# EAGLE design MoWeSta-Minimalist (EAGLE 9.6.2)
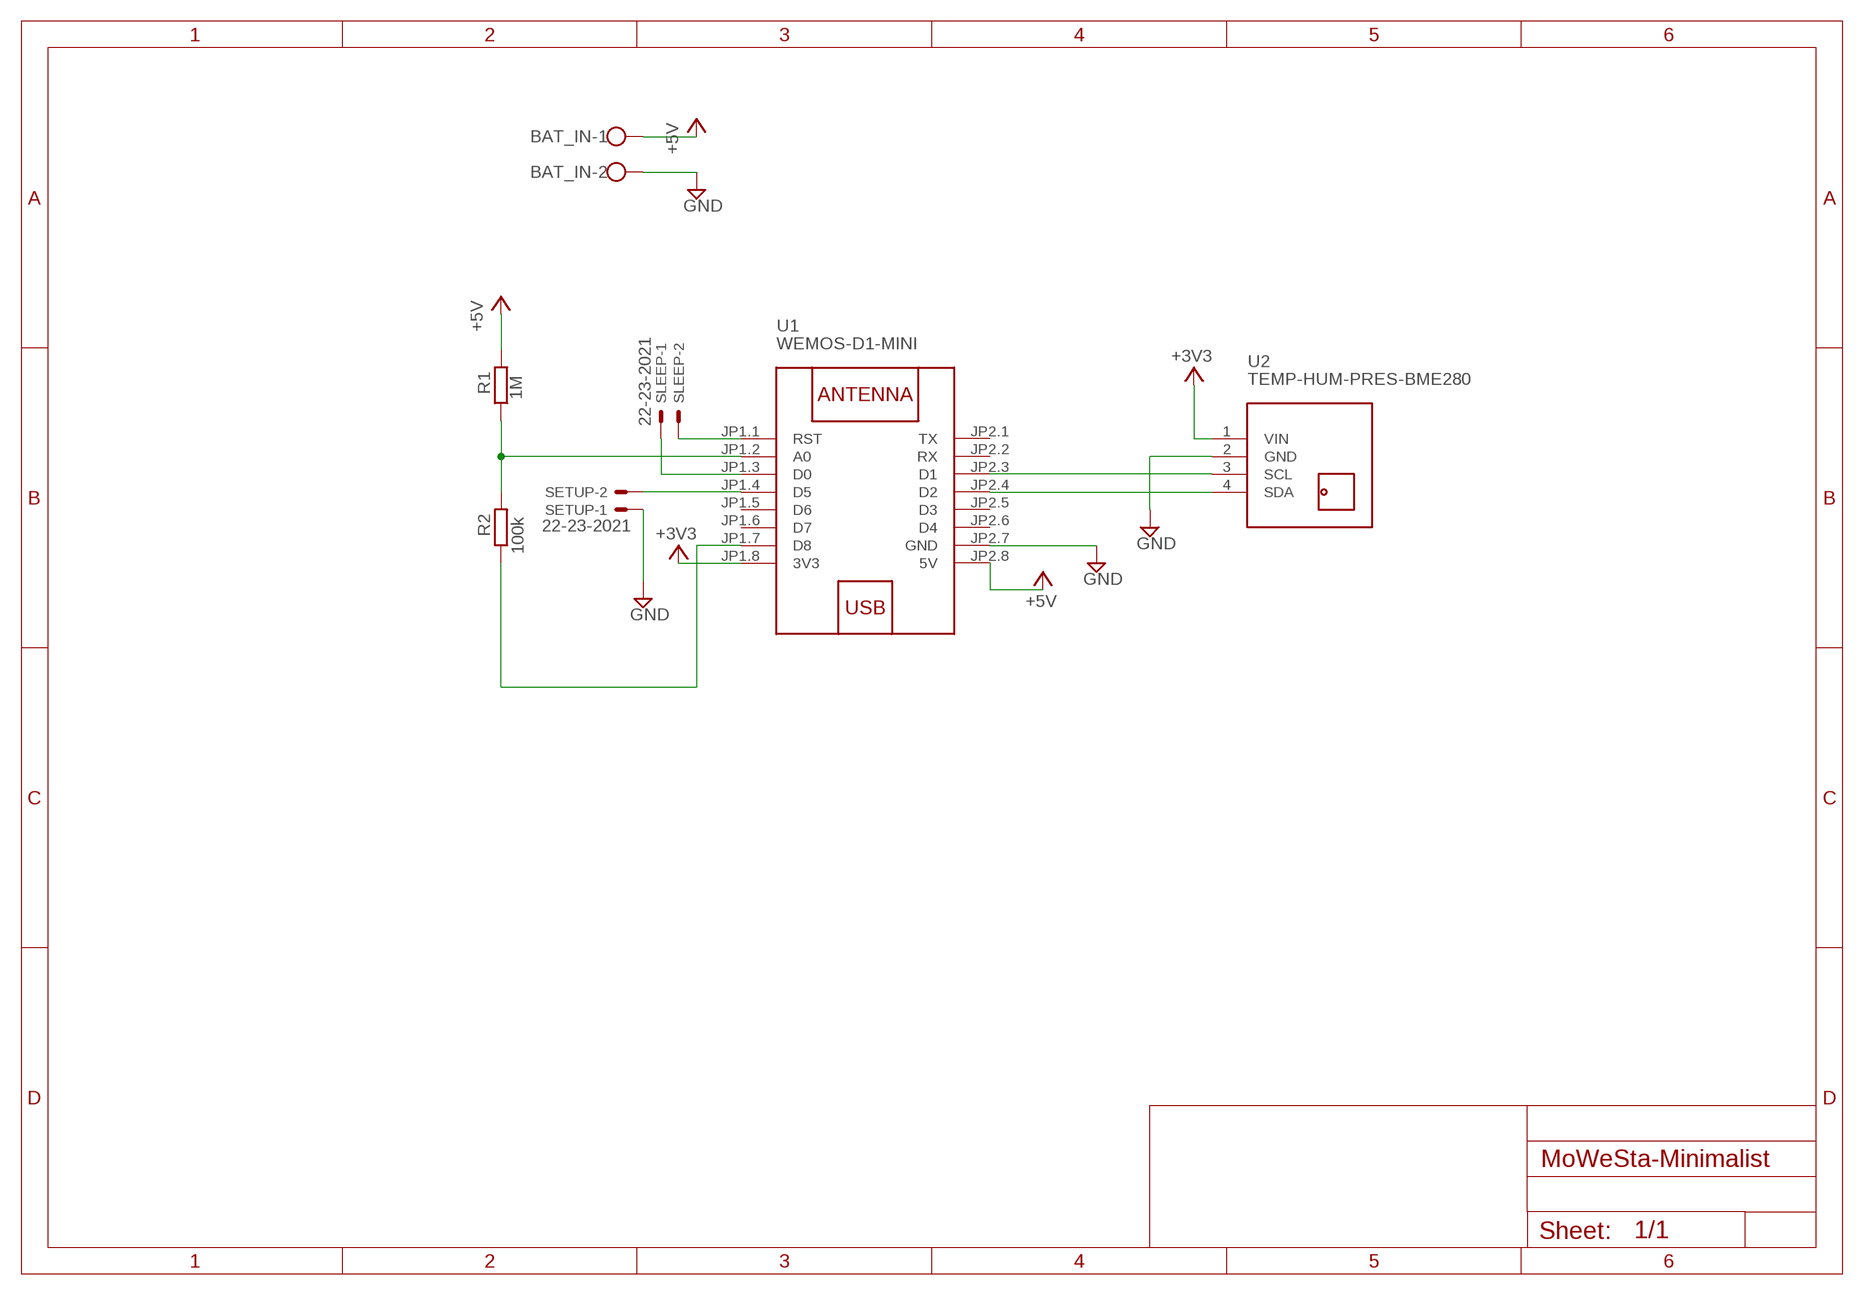
[diagram p0: schematic, sheet 1]

## Parts
BAT_IN  W237-102  [W237-102]
R1  1M  R-EU_0204/7  [0204/7]
R2  100k  R-EU_0204/7  [0204/7]
SETUP  22-23-2021  [22-23-2021]
SLEEP  22-23-2021  [22-23-2021]
U1  WEMOS-D1-MINI  [WEMOS-D1-MINI]
U2  TEMP-HUM-PRES-BME280  [TEMP-HUM-PRES-BME280]

## Nets
+3V3: U1.JP1.8(3V3) U2.1(VIN)
+5V: BAT_IN.1 R1.2 U1.JP2.8(5V)
GND: BAT_IN.2 SETUP.1 U1.JP2.7(GND) U2.2(GND)
N$1: R1.1 R2.2 U1.JP1.2(A0)
N$2: SLEEP.2 U1.JP1.1(RST)
N$3: SLEEP.1 U1.JP1.3(D0)
N$4: SETUP.2 U1.JP1.4(D5)
N$5: U1.JP2.3(D1) U2.3(SCL)
N$6: U1.JP2.4(D2) U2.4(SDA)
N$7: R2.1 U1.JP1.7(D8)
Unconnected: U1.JP1.5(D6) U1.JP1.6(D7) U1.JP2.1(TX) U1.JP2.2(RX) U1.JP2.5(D3) U1.JP2.6(D4)

## Library data of the parts
BAT_IN = con-wago-500:W237-102: WAGO SCREW CLAMP; MPN: 237-102; OC_FARNELL: unknown; OC_NEWARK: 70K9898
R1 R2 = rcl:R-EU_: RESISTOR, European symbol; SPICEPREFIX: R
SETUP SLEEP = con-molex:22-23-2021: .100" (2.54mm) Center Header - 2 Pin; MF: MOLEX; MPN: 22-23-2021; OC_FARNELL: 1462926; OC_NEWARK: 25C3832
U1 = diy-modules:WEMOS-D1-MINI: WEMOS D1 mini: Mini Wi-Fi Board based on ESP-8266 device More details can be found here: https://www.wemos.cc/product/d1-mini.html Click here to find device on ebay.com <http://www.ebay.com/sch/wemos+d1+mini+nodemcu>
U2 = diy-modules:TEMP-HUM-PRES-BME280: Digital Humidity-Temperature-Pressure Sensor based on BME280 device More information about BME280 device is available here: https://www.bosch-sensortec.com/bst/products/all_products/bme280 Click here to find device on ebay.com <http://www.ebay.com/sch/bme280+breakout>

## Board
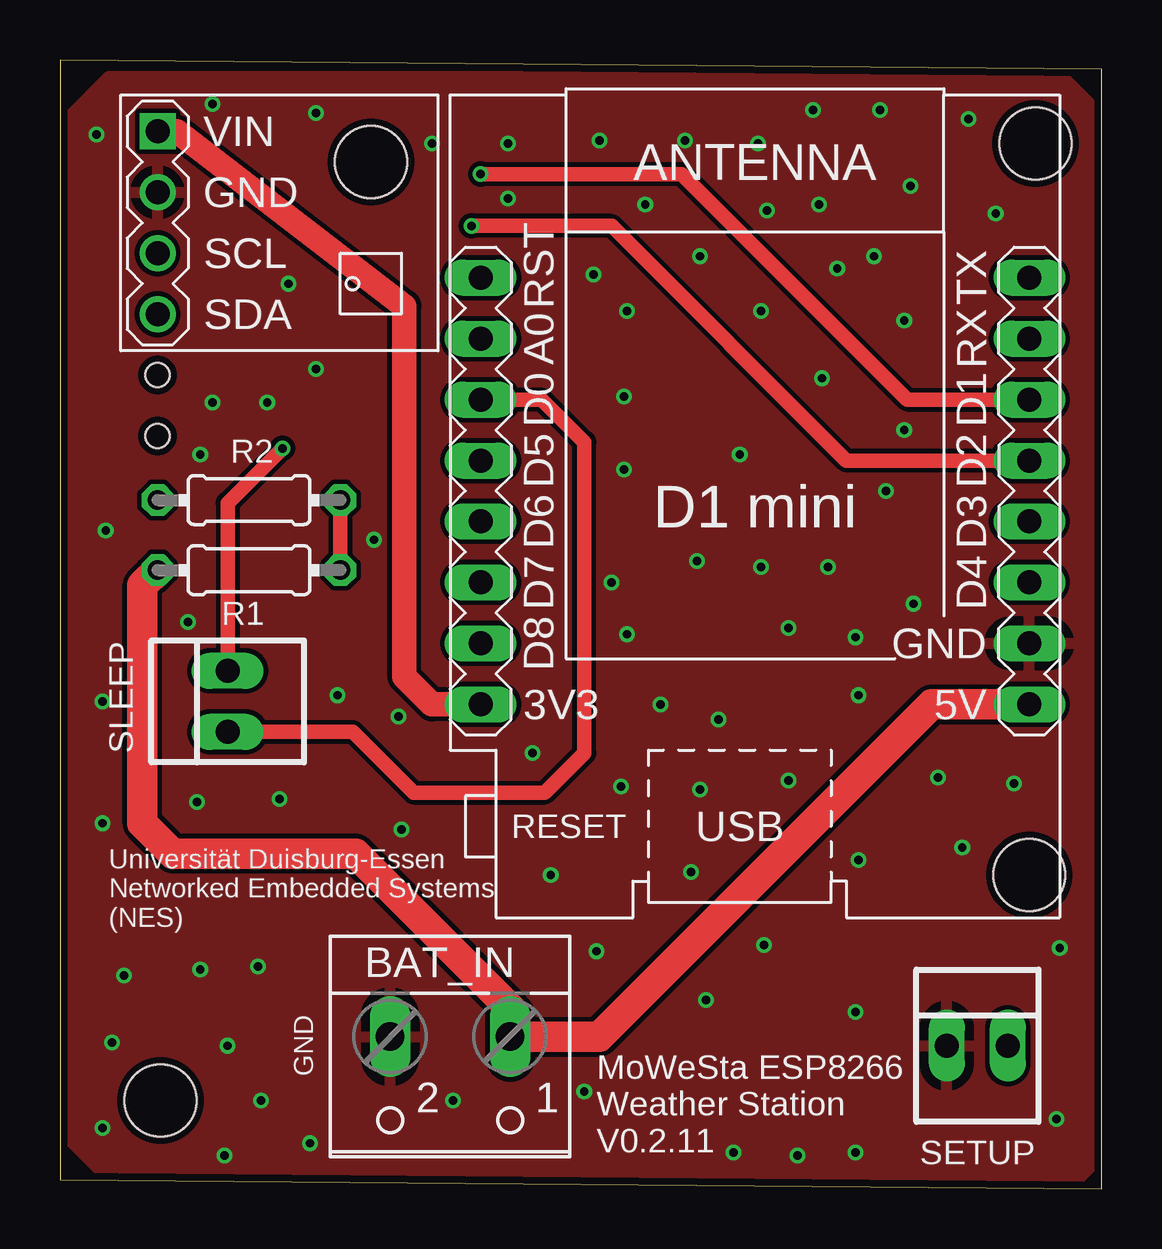
[diagram p1: board, top side]
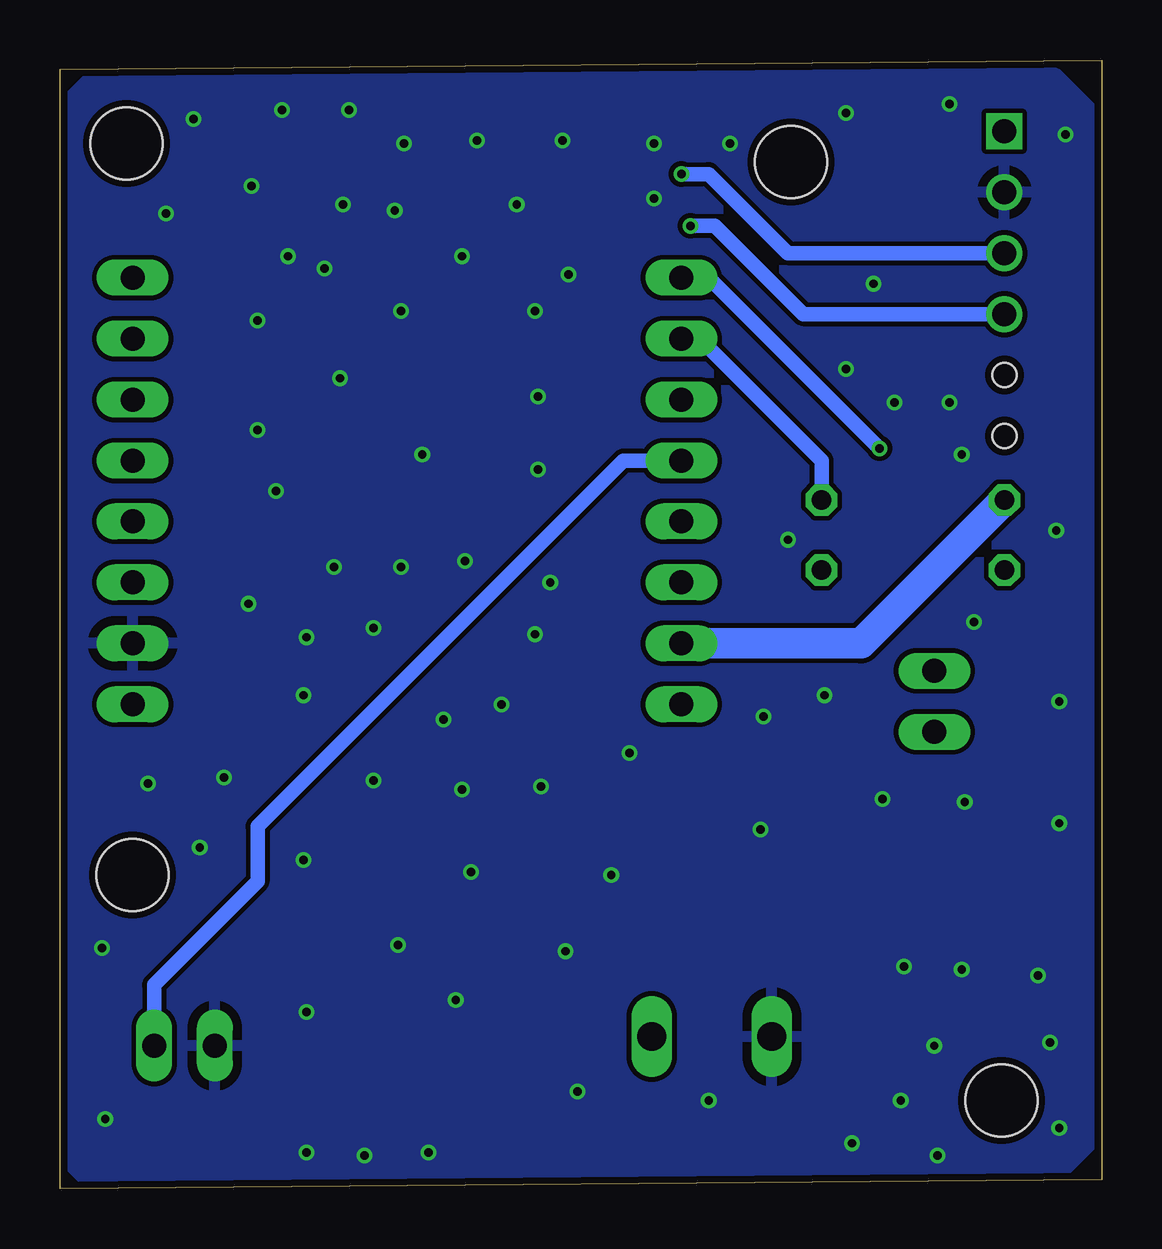
[diagram p2: board, bottom side, seen from below]

Size 43.41 x 47.04 mm. Coordinates in mm from the lower left corner, seen from the top.
Outline: 0,0.38 43.41,0 43.41,46.66 0,47.04 0,0.38
Copper layers (1*16): Top 0.035mm / dielectric 1.5mm / Bottom 0.035mm
Design rules "aisler_2_layer *": minimum track width 0.3mm, minimum drill 0.3mm, track to track 0.2mm, track to pad 0.2mm, pad to pad 0.1mm, via to via 0.1mm, smd to smd 0.1mm, copper to edge 0.3mm, drill to drill 0.4mm, minimum pad ring 0.25mm, minimum via ring 0.15mm, stop-mask expansion 0mil, vias tented up to drill 1mm, thermal gap 15mil
Holes 3 mm at 40.64,43.56 4.19,3.68 40.39,13.08
Holes 1 mm at 4.06,33.91 4.06,31.37

### Footprints (pad centres in the part's own frame; a part is rotated, then mirrored left to right if it is on the bottom)
W237-102 = drill 1.194 long: 1 -2.5,-1.27; 2 2.5,-1.27
0204/7 = drill 0.813 octagon: 1 -3.81,0; 2 3.81,0
22-23-2021 = drill 1 long: 1 -1.27,0; 2 1.27,0
WEMOS-D1-MINI = drill 1 long: JP1.1 -11.43,9.525; JP1.2 -11.43,6.985; JP1.3 -11.43,4.445; JP1.4 -11.43,1.905; JP1.5 -11.43,-0.635; JP1.6 -11.43,-3.175; JP1.7 -11.43,-5.715; JP1.8 -11.43,-8.255; JP2.1 11.43,9.525; JP2.2 11.43,6.985; JP2.3 11.43,4.445; JP2.4 11.43,1.905; JP2.5 11.43,-0.635; JP2.6 11.43,-3.175; JP2.7 11.43,-5.715; JP2.8 11.43,-8.255
TEMP-HUM-PRES-BME280 = drill 1 square: 1 -5.08,3.81 | drill 1: 2 -5.08,1.27; 3 -5.08,-1.27; 4 -5.08,-3.81 | hole 3: 3.81,2.54

### Placement (x,y rotation side)
BAT_IN  16.26,5.08 180 top
R1  7.87,25.78 180 top
R2  7.87,28.7 0 top
SETUP  38.23,5.97 0 top
SLEEP  6.99,20.32 90 top
U1  28.96,28.45 0 top
U2  9.14,40.26 0 top

### Tracks (layer width: path | path; a pad name or v marks a point on that pad's centre or on a via)
+3V3
  Top 1.016: U1.JP1.8 15.49,20.19 14.35,21.34 14.35,36.79 4.86,44.07 U2.1
+5V
  Top 1.27: U1.JP2.8 36.32,20.19 22.48,6.35 BAT_IN.1 18.76,7.53 12.32,13.97 4.7,13.97 3.43,15.24 3.43,25.15 R1.2
GND  (via drill 0.35)
  other vias: 10.67,44.83 10.67,34.16 15.49,43.56 18.67,43.56 22.48,43.69 31.62,41.02 33.91,38.86 35.18,36.2 26.04,43.69 29.08,43.56 31.37,44.96 34.16,44.96 35.43,41.78 38.99,40.64 29.46,40.77 23.62,36.58 37.85,44.58 23.5,33.02 34.42,29.08 22.99,25.27 18.67,41.27 29.21,36.58 24.38,41.02 16.38,3.68 28.32,30.61 35.56,24.38 31.75,33.78 23.5,29.97 35.18,31.62 32.38,38.35 9.52,37.72 11.56,20.57 29.21,25.91 23.62,23.11 26.54,26.16 30.35,23.37 32,25.91 33.15,22.99 26.67,38.86 36.58,17.14 39.75,16.89 25.02,20.19 27.43,19.56 26.67,16.64 30.35,17.02 26.29,13.21 20.45,13.08 14.22,14.99 14.1,19.68 19.68,18.16 5.33,23.62 13.08,27.05 5.84,30.61 2.67,8.89 2.16,6.1 8.38,3.68 6.99,5.97 8.25,9.27 28.07,1.52 30.73,1.4 33.15,1.52 41.53,2.92 41.66,10.03 37.59,14.22 29.34,10.16 33.27,13.72 33.15,7.37 26.92,7.87 22.35,9.91 9.14,16.26 5.71,16.13 5.84,9.14 1.78,2.54 6.86,1.4 10.41,1.91 1.78,20.32 1.91,27.43 1.78,15.24 8.64,32.77 1.52,43.94 6.35,45.21 6.35,32.77 22.22,38.1 33.27,20.57 23.37,16.76 21.84,4.06
  pour Top: 2.03,46.35 41.78,46.35 43.18,44.96 43.18,1.14 42.55,0.51 1.91,0.51 0.38,2.03 0.38,44.7
  pour Bottom: 1.91,46.48 42.04,46.48 43.18,45.34 43.18,1.14 42.42,0.38 1.91,0.38 0.38,1.91 0.38,44.96
N$1
  Top 0.61: R2.2 R1.1
  Bottom 0.61: R2.2 11.68,30.35 16.76,35.43 U1.JP1.2
N$2  (via drill 0.35)
  Top 0.61: v9.27,30.86 6.99,28.57 SLEEP.2
  Bottom 0.61: U1.JP1.1 16.38,37.97 v9.27,30.86
N$3
  Top 0.61: SLEEP.1 12.19,19.05 14.73,16.51 20.19,16.51 21.84,18.16 21.84,31.11 20.07,32.89 U1.JP1.3
N$4
  Bottom 0.61: U1.JP1.4 19.94,30.35 35.18,15.11 35.18,12.83 39.5,8.51 SETUP.2
N$5  (via drill 0.35)
  Top 0.61: v17.53,42.29 25.91,42.29 35.31,32.89 U1.JP2.3
  Bottom 0.61: v17.53,42.29 16.38,42.29 13.08,38.99 U2.3
N$6  (via drill 0.35)
  Top 0.61: v17.14,40.13 22.99,40.13 32.77,30.35 U1.JP2.4
  Bottom 0.61: v17.14,40.13 16.13,40.13 12.45,36.45 U2.4
N$7
  Bottom 1.27: U1.JP1.7 10.03,22.73 4.76,28 R2.1

### Text on the board
tNames: Universität Duisburg-Essen / Networked Embedded Systems / (NES) | GND | MoWeSta ESP8266 / Weather Station / V0.2.11